# EAGLE design basicComplexSchematicWith2Parts (EAGLE 7.4.0)
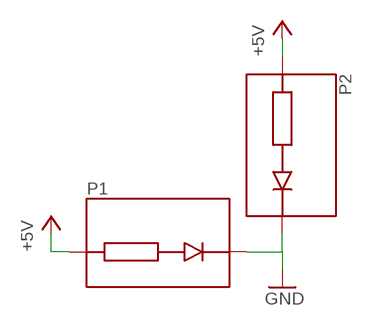
[diagram p0: schematic, sheet 1]

## Parts
P1  SIMPLE_LED  [SIMPLE_LED]
P2  SIMPLE_LED  [SIMPLE_LED]

## Nets
+5V: P1.ANODE P2.ANODE
GND: P1.CATHODE P2.CATHODE

## Library data of the parts
P1 P2 = p.peter-test:SIMPLE_LED

## Board
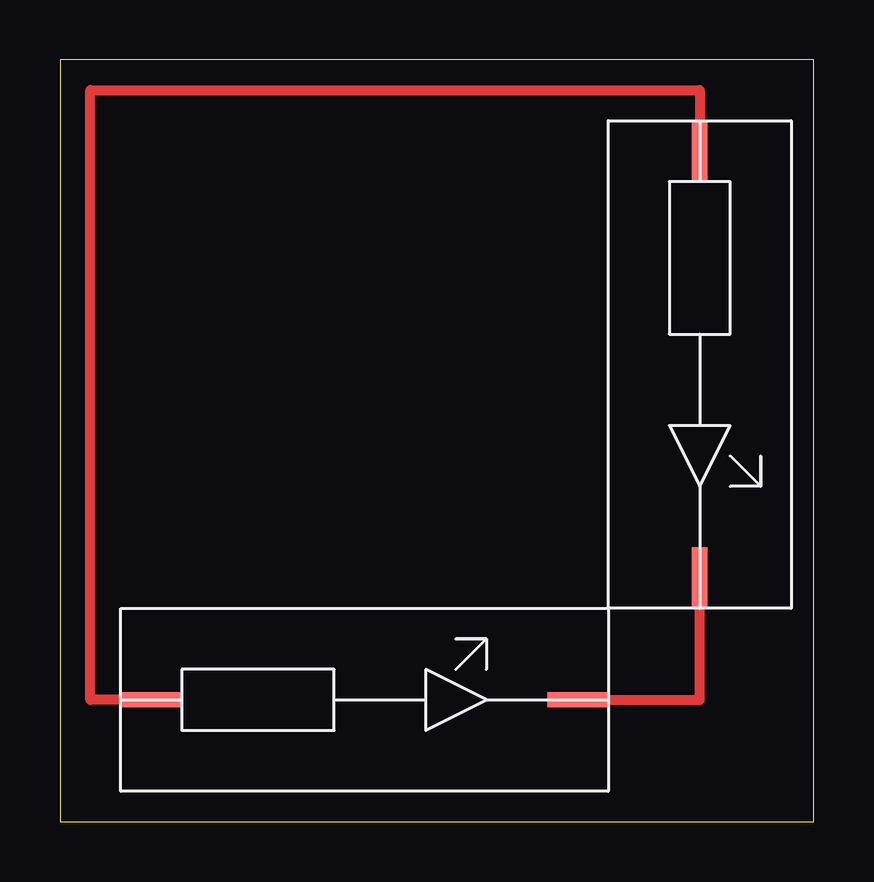
[diagram p1: board, top side]

Size 31.42 x 31.74 mm. Coordinates in mm from the lower left corner, seen from the top.
Outline: 0,0 31.42,0 31.42,31.74 0,31.74 0,0
Copper layers (1*16): Top 0.035mm / dielectric 1.5mm / Bottom 0.035mm
Design rules "default": minimum track width 10mil, minimum drill 24mil, track to track 8mil, track to pad 8mil, pad to pad 8mil, via to via 8mil, smd to smd 8mil, copper to edge 40mil, drill to drill 8mil, minimum pad ring 10mil, minimum via ring 8mil, stop-mask expansion 4mil, vias tented up to drill 0mil, thermal gap 10mil

### Footprints (pad centres in the part's own frame; a part is rotated, then mirrored left to right if it is on the bottom)
SIMPLE_LED = smd 2.54 x 0.635: ANODE 1.27,3.81; CATHODE 19.05,3.81

### Placement (x,y rotation side)
P1  2.54,1.27 0 top
P2  22.86,29.21 270 top

### Tracks (layer width: path | path; a pad name or v marks a point on that pad's centre or on a via)
+5V
  Top 0.406: P1.ANODE 1.27,5.08 1.27,30.48 26.67,30.48 P2.ANODE
GND
  Top 0.406: P1.CATHODE 26.67,5.08 P2.CATHODE